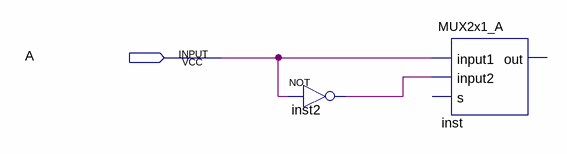
[diagram p0: schematic sheet]
// Quartus schematic block_MUX2x1_A.bdf as structural Verilog: 2 symbols, 1 pins
module block_MUX2x1_A (
  input  A
);

  wire inst2_out;

  not inst2 (inst2_out, A);
  MUX2x1_A inst (.input1(A), .input2(inst2_out));  // open: s, out
endmodule
